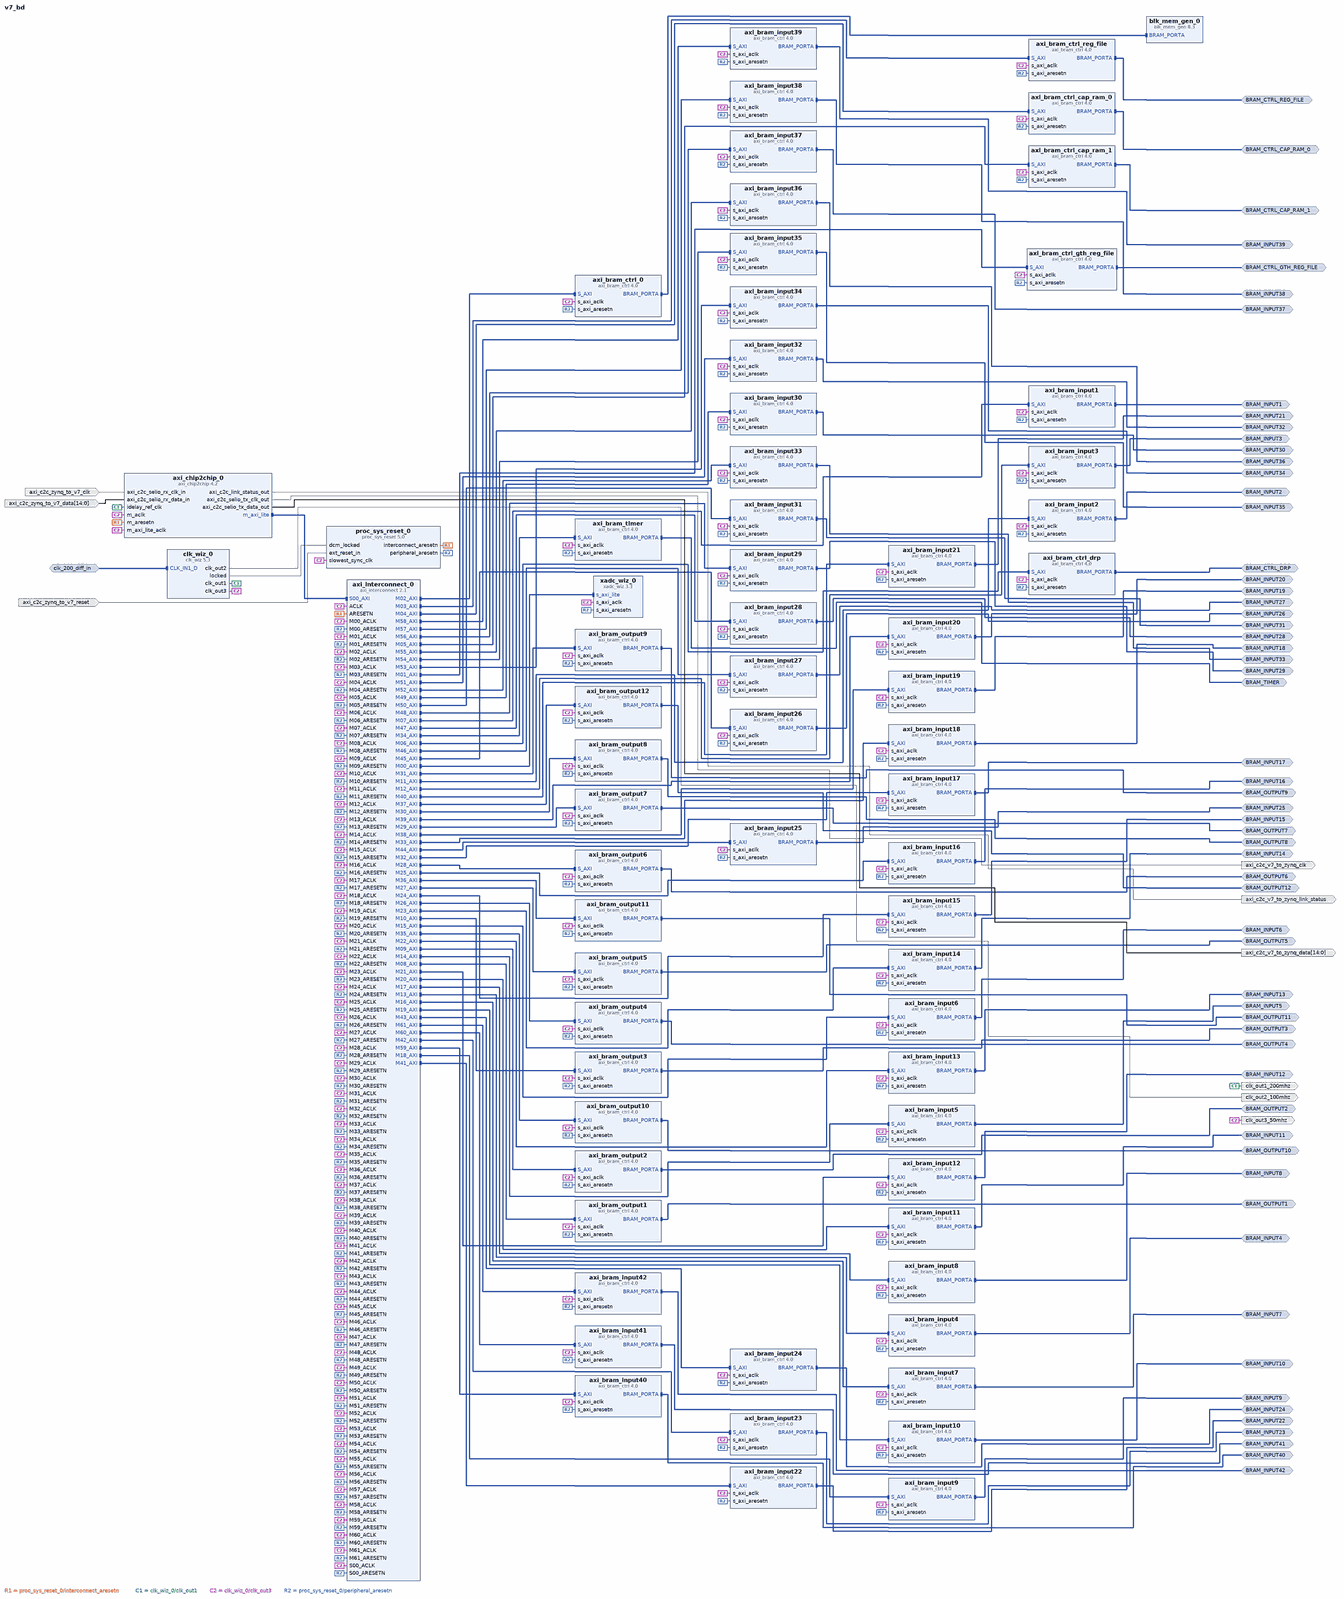
[diagram p0: block diagram of the top level, whole]
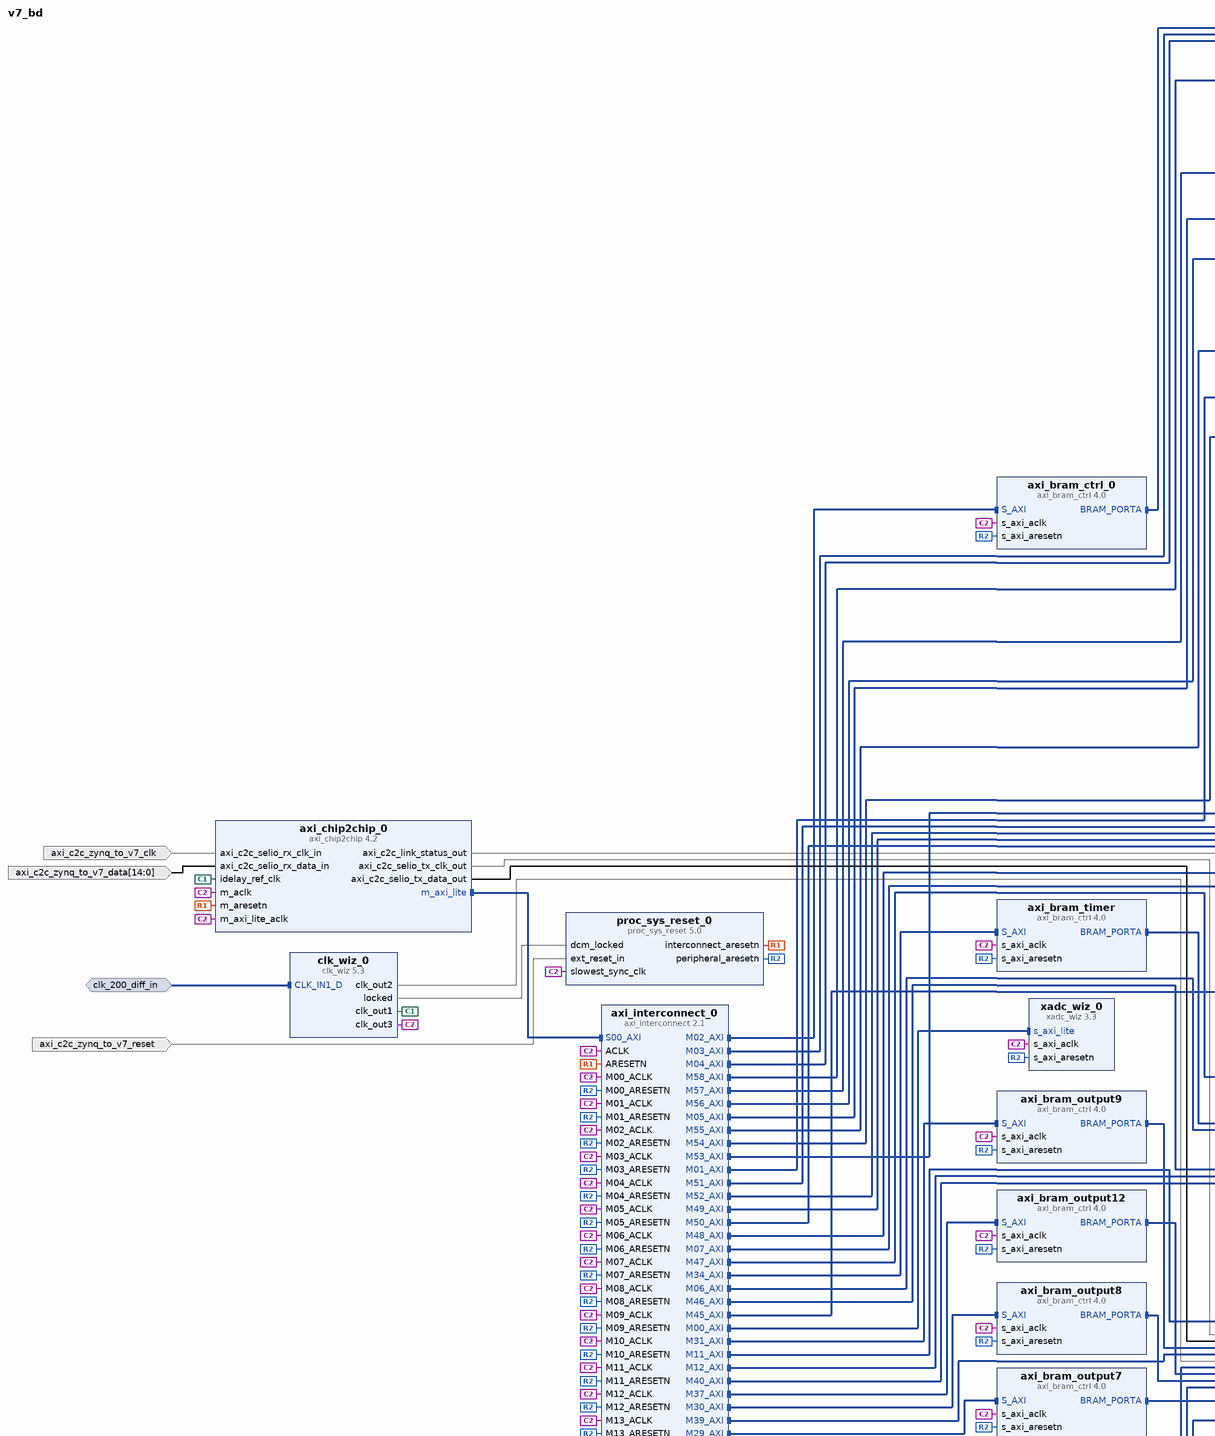
[diagram p1: block diagram of the top level, upper left part]
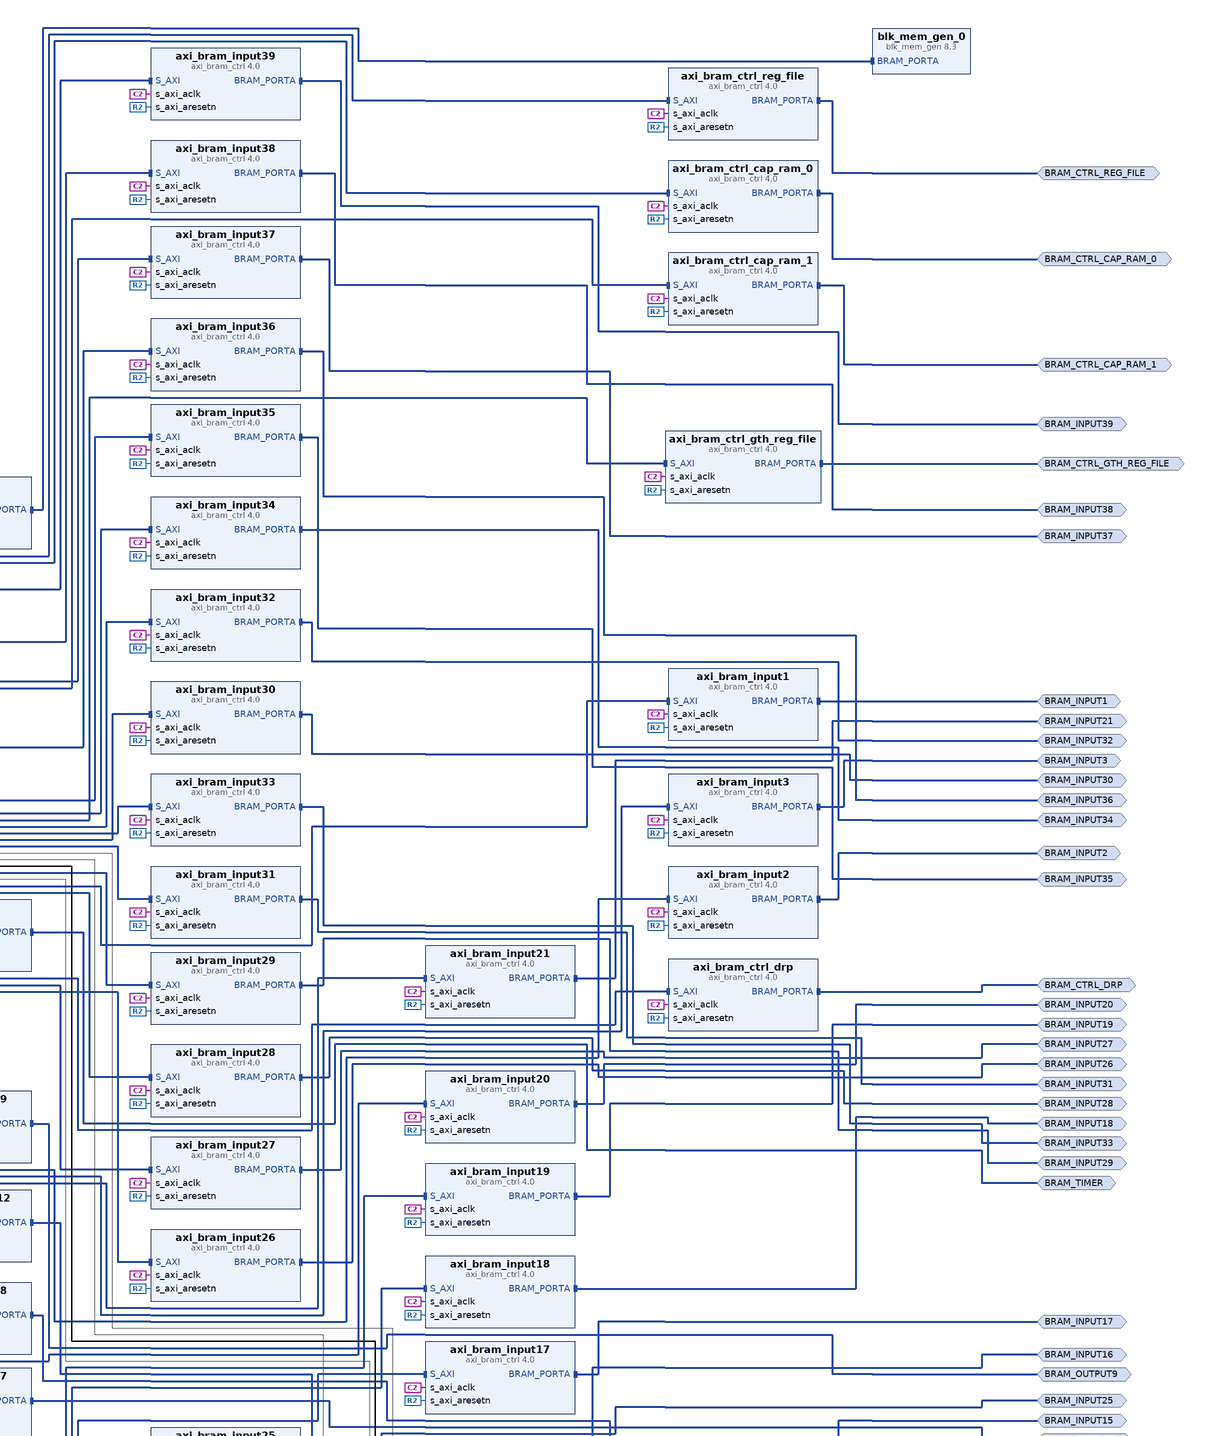
[diagram p2: block diagram of the top level, upper right part]
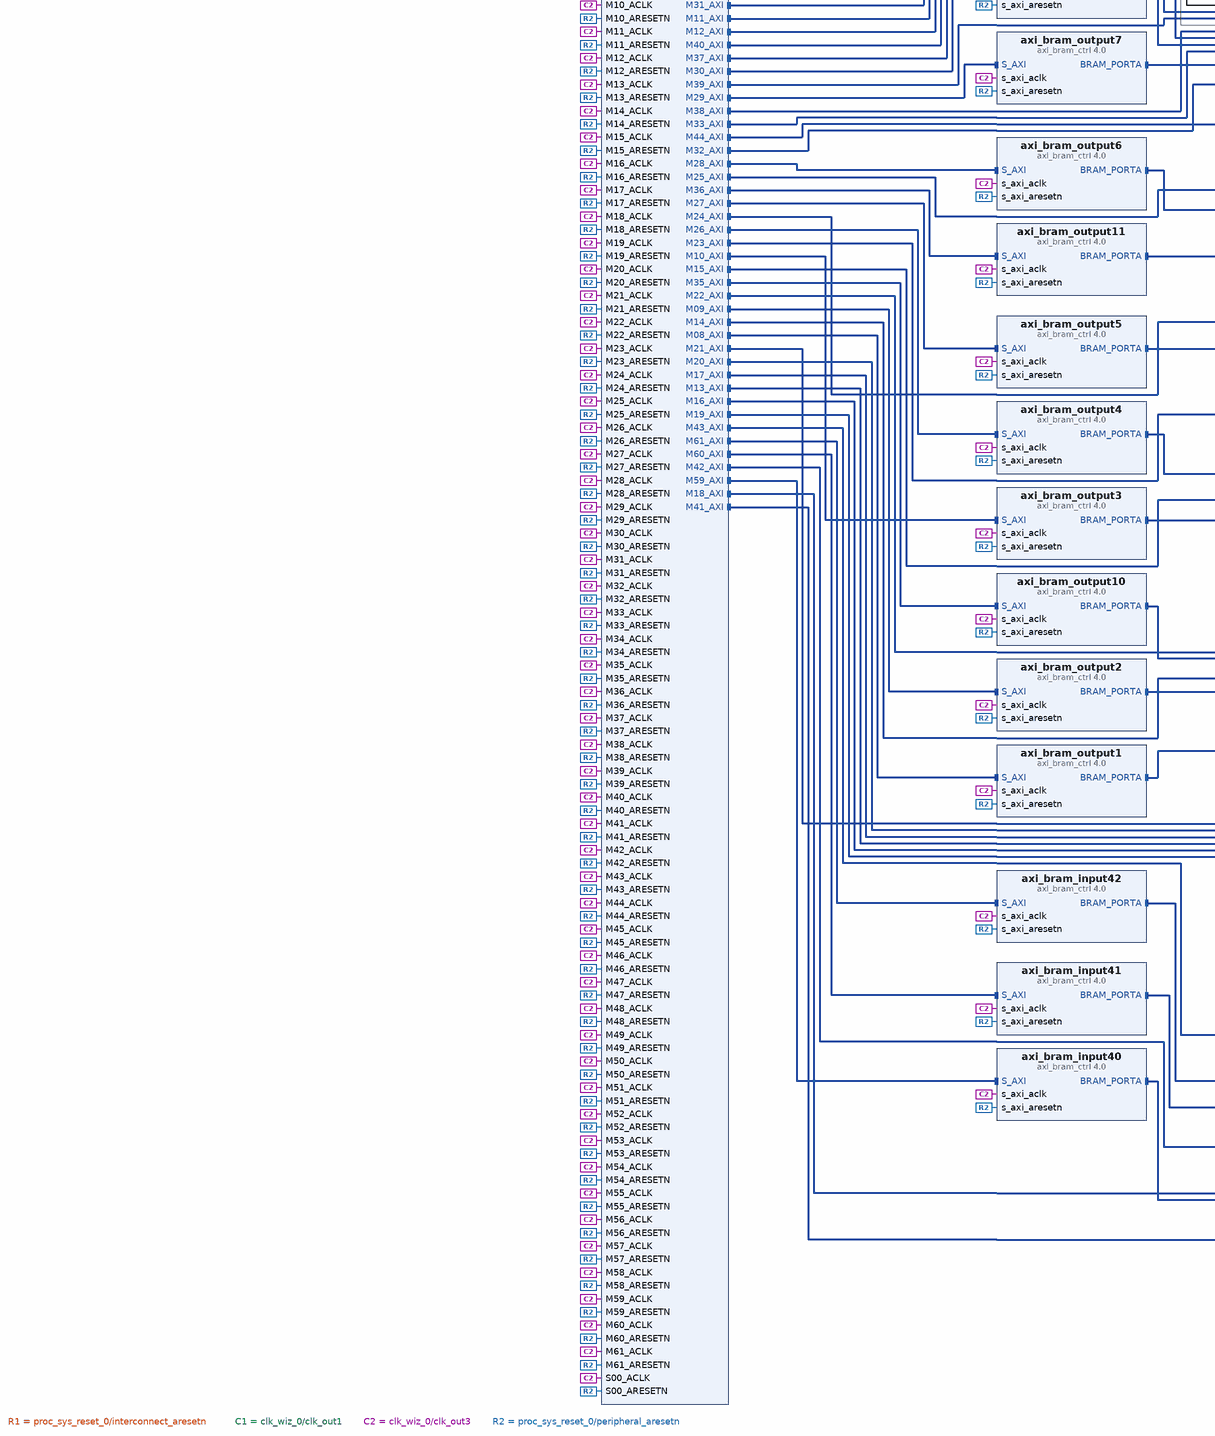
[diagram p3: block diagram of the top level, lower left part]
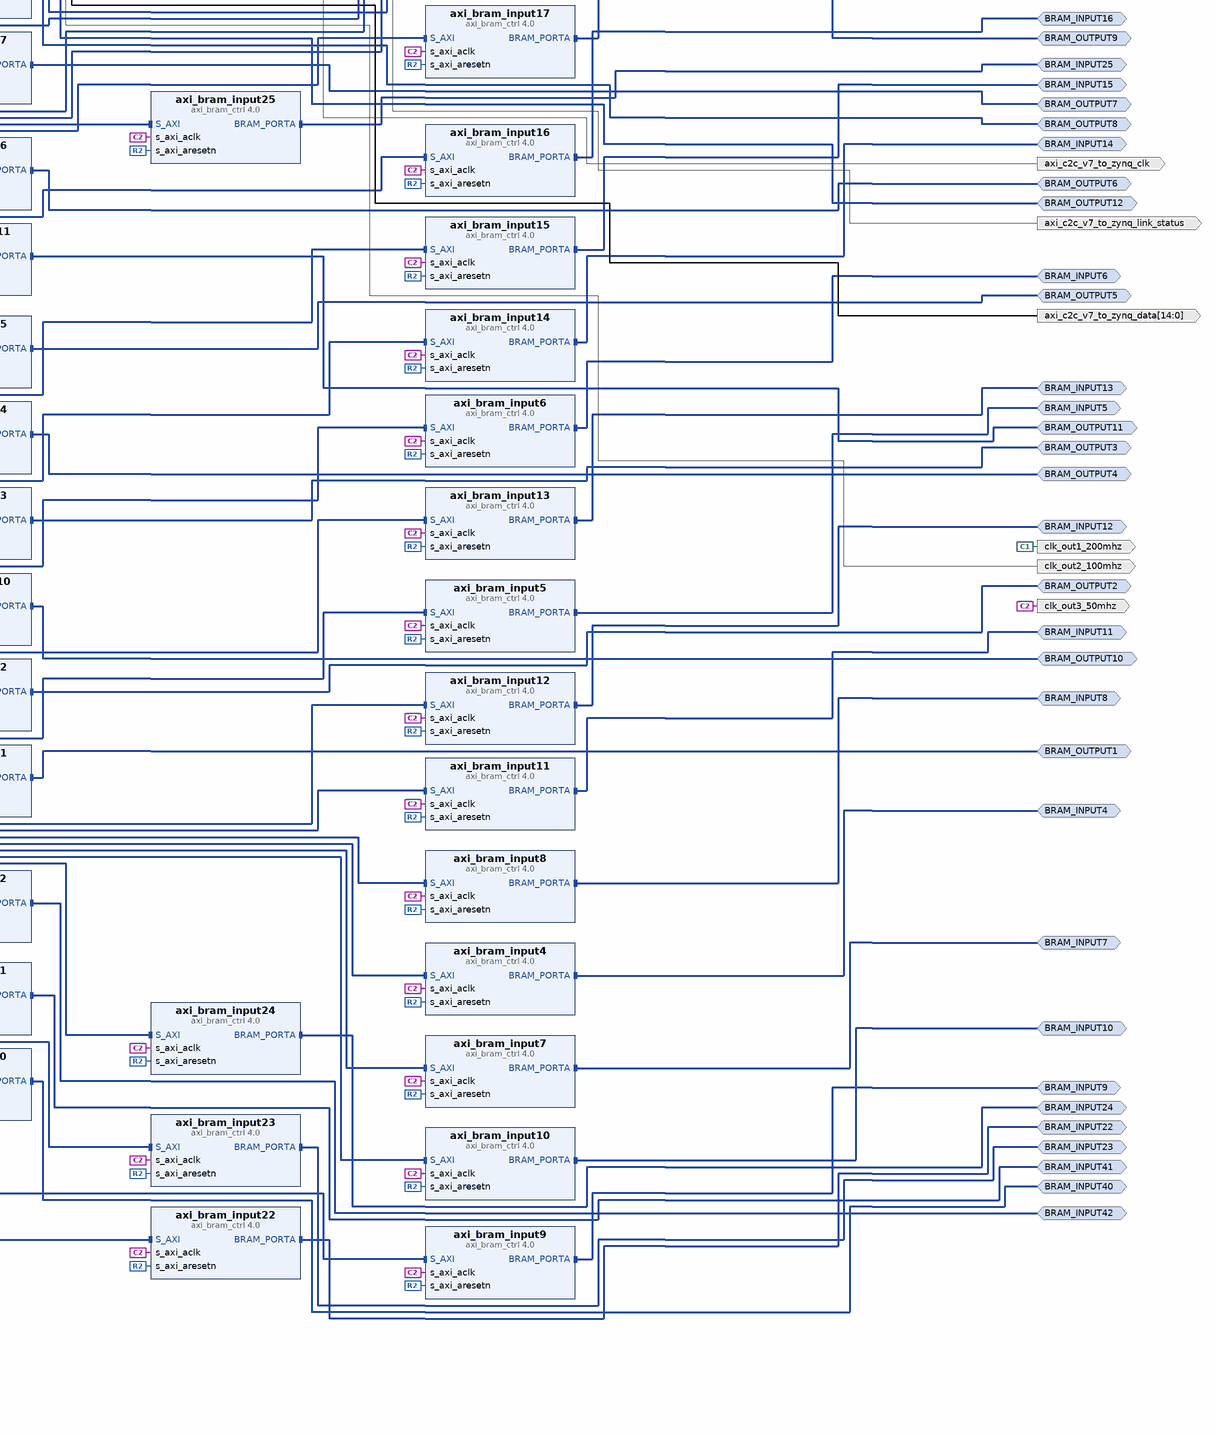
[diagram p4: block diagram of the top level, lower right part]
# Vivado block design v7_bd, Vivado 2016.1
create_bd_design v7_bd

create_bd_intf_port -mode Master -vlnv xilinx.com:interface:bram_rtl:1.0 BRAM_CTRL_CAP_RAM_0
set_property -dict {CONFIG.MASTER_TYPE BRAM_CTRL} [get_bd_intf_ports BRAM_CTRL_CAP_RAM_0]
create_bd_intf_port -mode Master -vlnv xilinx.com:interface:bram_rtl:1.0 BRAM_CTRL_CAP_RAM_1
set_property -dict {CONFIG.MASTER_TYPE BRAM_CTRL} [get_bd_intf_ports BRAM_CTRL_CAP_RAM_1]
create_bd_intf_port -mode Master -vlnv xilinx.com:interface:bram_rtl:1.0 BRAM_CTRL_DRP
set_property -dict {CONFIG.MASTER_TYPE BRAM_CTRL} [get_bd_intf_ports BRAM_CTRL_DRP]
create_bd_intf_port -mode Master -vlnv xilinx.com:interface:bram_rtl:1.0 BRAM_CTRL_REG_FILE
set_property -dict {CONFIG.MASTER_TYPE BRAM_CTRL} [get_bd_intf_ports BRAM_CTRL_REG_FILE]
create_bd_intf_port -mode Slave -vlnv xilinx.com:interface:diff_clock_rtl:1.0 clk_200_diff_in
set_property -dict {CONFIG.FREQ_HZ 200000000} [get_bd_intf_ports clk_200_diff_in]
create_bd_intf_port -mode Master -vlnv xilinx.com:interface:bram_rtl:1.0 BRAM_CTRL_GTH_REG_FILE
set_property -dict {CONFIG.MASTER_TYPE BRAM_CTRL} [get_bd_intf_ports BRAM_CTRL_GTH_REG_FILE]
create_bd_intf_port -mode Master -vlnv xilinx.com:interface:bram_rtl:1.0 BRAM_INPUT1
set_property -dict {CONFIG.MASTER_TYPE BRAM_CTRL} [get_bd_intf_ports BRAM_INPUT1]
create_bd_intf_port -mode Master -vlnv xilinx.com:interface:bram_rtl:1.0 BRAM_OUTPUT1
set_property -dict {CONFIG.MASTER_TYPE BRAM_CTRL} [get_bd_intf_ports BRAM_OUTPUT1]
create_bd_intf_port -mode Master -vlnv xilinx.com:interface:bram_rtl:1.0 BRAM_OUTPUT2
set_property -dict {CONFIG.MASTER_TYPE BRAM_CTRL} [get_bd_intf_ports BRAM_OUTPUT2]
create_bd_intf_port -mode Master -vlnv xilinx.com:interface:bram_rtl:1.0 BRAM_OUTPUT3
set_property -dict {CONFIG.MASTER_TYPE BRAM_CTRL} [get_bd_intf_ports BRAM_OUTPUT3]
create_bd_intf_port -mode Master -vlnv xilinx.com:interface:bram_rtl:1.0 BRAM_INPUT2
set_property -dict {CONFIG.MASTER_TYPE BRAM_CTRL} [get_bd_intf_ports BRAM_INPUT2]
create_bd_intf_port -mode Master -vlnv xilinx.com:interface:bram_rtl:1.0 BRAM_INPUT3
set_property -dict {CONFIG.MASTER_TYPE BRAM_CTRL} [get_bd_intf_ports BRAM_INPUT3]
create_bd_intf_port -mode Master -vlnv xilinx.com:interface:bram_rtl:1.0 BRAM_INPUT4
set_property -dict {CONFIG.MASTER_TYPE BRAM_CTRL} [get_bd_intf_ports BRAM_INPUT4]
create_bd_intf_port -mode Master -vlnv xilinx.com:interface:bram_rtl:1.0 BRAM_INPUT5
set_property -dict {CONFIG.MASTER_TYPE BRAM_CTRL} [get_bd_intf_ports BRAM_INPUT5]
create_bd_intf_port -mode Master -vlnv xilinx.com:interface:bram_rtl:1.0 BRAM_INPUT6
set_property -dict {CONFIG.MASTER_TYPE BRAM_CTRL} [get_bd_intf_ports BRAM_INPUT6]
create_bd_intf_port -mode Master -vlnv xilinx.com:interface:bram_rtl:1.0 BRAM_OUTPUT4
set_property -dict {CONFIG.MASTER_TYPE BRAM_CTRL} [get_bd_intf_ports BRAM_OUTPUT4]
create_bd_intf_port -mode Master -vlnv xilinx.com:interface:bram_rtl:1.0 BRAM_OUTPUT5
set_property -dict {CONFIG.MASTER_TYPE BRAM_CTRL} [get_bd_intf_ports BRAM_OUTPUT5]
create_bd_intf_port -mode Master -vlnv xilinx.com:interface:bram_rtl:1.0 BRAM_OUTPUT6
set_property -dict {CONFIG.MASTER_TYPE BRAM_CTRL} [get_bd_intf_ports BRAM_OUTPUT6]
create_bd_intf_port -mode Master -vlnv xilinx.com:interface:bram_rtl:1.0 BRAM_OUTPUT7
set_property -dict {CONFIG.MASTER_TYPE BRAM_CTRL} [get_bd_intf_ports BRAM_OUTPUT7]
create_bd_intf_port -mode Master -vlnv xilinx.com:interface:bram_rtl:1.0 BRAM_OUTPUT8
set_property -dict {CONFIG.MASTER_TYPE BRAM_CTRL} [get_bd_intf_ports BRAM_OUTPUT8]
create_bd_intf_port -mode Master -vlnv xilinx.com:interface:bram_rtl:1.0 BRAM_OUTPUT9
set_property -dict {CONFIG.MASTER_TYPE BRAM_CTRL} [get_bd_intf_ports BRAM_OUTPUT9]
create_bd_intf_port -mode Master -vlnv xilinx.com:interface:bram_rtl:1.0 BRAM_INPUT7
set_property -dict {CONFIG.MASTER_TYPE BRAM_CTRL} [get_bd_intf_ports BRAM_INPUT7]
create_bd_intf_port -mode Master -vlnv xilinx.com:interface:bram_rtl:1.0 BRAM_INPUT8
set_property -dict {CONFIG.MASTER_TYPE BRAM_CTRL} [get_bd_intf_ports BRAM_INPUT8]
create_bd_intf_port -mode Master -vlnv xilinx.com:interface:bram_rtl:1.0 BRAM_INPUT9
set_property -dict {CONFIG.MASTER_TYPE BRAM_CTRL} [get_bd_intf_ports BRAM_INPUT9]
create_bd_intf_port -mode Master -vlnv xilinx.com:interface:bram_rtl:1.0 BRAM_INPUT10
set_property -dict {CONFIG.MASTER_TYPE BRAM_CTRL} [get_bd_intf_ports BRAM_INPUT10]
create_bd_intf_port -mode Master -vlnv xilinx.com:interface:bram_rtl:1.0 BRAM_INPUT11
set_property -dict {CONFIG.MASTER_TYPE BRAM_CTRL} [get_bd_intf_ports BRAM_INPUT11]
create_bd_intf_port -mode Master -vlnv xilinx.com:interface:bram_rtl:1.0 BRAM_INPUT12
set_property -dict {CONFIG.MASTER_TYPE BRAM_CTRL} [get_bd_intf_ports BRAM_INPUT12]
create_bd_intf_port -mode Master -vlnv xilinx.com:interface:bram_rtl:1.0 BRAM_INPUT13
set_property -dict {CONFIG.MASTER_TYPE BRAM_CTRL} [get_bd_intf_ports BRAM_INPUT13]
create_bd_intf_port -mode Master -vlnv xilinx.com:interface:bram_rtl:1.0 BRAM_INPUT14
set_property -dict {CONFIG.MASTER_TYPE BRAM_CTRL} [get_bd_intf_ports BRAM_INPUT14]
create_bd_intf_port -mode Master -vlnv xilinx.com:interface:bram_rtl:1.0 BRAM_INPUT15
set_property -dict {CONFIG.MASTER_TYPE BRAM_CTRL} [get_bd_intf_ports BRAM_INPUT15]
create_bd_intf_port -mode Master -vlnv xilinx.com:interface:bram_rtl:1.0 BRAM_INPUT16
set_property -dict {CONFIG.MASTER_TYPE BRAM_CTRL} [get_bd_intf_ports BRAM_INPUT16]
create_bd_intf_port -mode Master -vlnv xilinx.com:interface:bram_rtl:1.0 BRAM_INPUT17
set_property -dict {CONFIG.MASTER_TYPE BRAM_CTRL} [get_bd_intf_ports BRAM_INPUT17]
create_bd_intf_port -mode Master -vlnv xilinx.com:interface:bram_rtl:1.0 BRAM_INPUT18
set_property -dict {CONFIG.MASTER_TYPE BRAM_CTRL} [get_bd_intf_ports BRAM_INPUT18]
create_bd_intf_port -mode Master -vlnv xilinx.com:interface:bram_rtl:1.0 BRAM_TIMER
set_property -dict {CONFIG.MASTER_TYPE BRAM_CTRL} [get_bd_intf_ports BRAM_TIMER]
create_bd_intf_port -mode Master -vlnv xilinx.com:interface:bram_rtl:1.0 BRAM_OUTPUT10
set_property -dict {CONFIG.MASTER_TYPE BRAM_CTRL} [get_bd_intf_ports BRAM_OUTPUT10]
create_bd_intf_port -mode Master -vlnv xilinx.com:interface:bram_rtl:1.0 BRAM_OUTPUT11
set_property -dict {CONFIG.MASTER_TYPE BRAM_CTRL} [get_bd_intf_ports BRAM_OUTPUT11]
create_bd_intf_port -mode Master -vlnv xilinx.com:interface:bram_rtl:1.0 BRAM_OUTPUT12
set_property -dict {CONFIG.MASTER_TYPE BRAM_CTRL} [get_bd_intf_ports BRAM_OUTPUT12]
create_bd_intf_port -mode Master -vlnv xilinx.com:interface:bram_rtl:1.0 BRAM_INPUT19
set_property -dict {CONFIG.MASTER_TYPE BRAM_CTRL} [get_bd_intf_ports BRAM_INPUT19]
create_bd_intf_port -mode Master -vlnv xilinx.com:interface:bram_rtl:1.0 BRAM_INPUT20
set_property -dict {CONFIG.MASTER_TYPE BRAM_CTRL} [get_bd_intf_ports BRAM_INPUT20]
create_bd_intf_port -mode Master -vlnv xilinx.com:interface:bram_rtl:1.0 BRAM_INPUT21
set_property -dict {CONFIG.MASTER_TYPE BRAM_CTRL} [get_bd_intf_ports BRAM_INPUT21]
create_bd_intf_port -mode Master -vlnv xilinx.com:interface:bram_rtl:1.0 BRAM_INPUT22
set_property -dict {CONFIG.MASTER_TYPE BRAM_CTRL} [get_bd_intf_ports BRAM_INPUT22]
create_bd_intf_port -mode Master -vlnv xilinx.com:interface:bram_rtl:1.0 BRAM_INPUT23
set_property -dict {CONFIG.MASTER_TYPE BRAM_CTRL} [get_bd_intf_ports BRAM_INPUT23]
create_bd_intf_port -mode Master -vlnv xilinx.com:interface:bram_rtl:1.0 BRAM_INPUT24
set_property -dict {CONFIG.MASTER_TYPE BRAM_CTRL} [get_bd_intf_ports BRAM_INPUT24]
create_bd_intf_port -mode Master -vlnv xilinx.com:interface:bram_rtl:1.0 BRAM_INPUT25
set_property -dict {CONFIG.MASTER_TYPE BRAM_CTRL} [get_bd_intf_ports BRAM_INPUT25]
create_bd_intf_port -mode Master -vlnv xilinx.com:interface:bram_rtl:1.0 BRAM_INPUT26
set_property -dict {CONFIG.MASTER_TYPE BRAM_CTRL} [get_bd_intf_ports BRAM_INPUT26]
create_bd_intf_port -mode Master -vlnv xilinx.com:interface:bram_rtl:1.0 BRAM_INPUT27
set_property -dict {CONFIG.MASTER_TYPE BRAM_CTRL} [get_bd_intf_ports BRAM_INPUT27]
create_bd_intf_port -mode Master -vlnv xilinx.com:interface:bram_rtl:1.0 BRAM_INPUT28
set_property -dict {CONFIG.MASTER_TYPE BRAM_CTRL} [get_bd_intf_ports BRAM_INPUT28]
create_bd_intf_port -mode Master -vlnv xilinx.com:interface:bram_rtl:1.0 BRAM_INPUT29
set_property -dict {CONFIG.MASTER_TYPE BRAM_CTRL} [get_bd_intf_ports BRAM_INPUT29]
create_bd_intf_port -mode Master -vlnv xilinx.com:interface:bram_rtl:1.0 BRAM_INPUT30
set_property -dict {CONFIG.MASTER_TYPE BRAM_CTRL} [get_bd_intf_ports BRAM_INPUT30]
create_bd_intf_port -mode Master -vlnv xilinx.com:interface:bram_rtl:1.0 BRAM_INPUT31
set_property -dict {CONFIG.MASTER_TYPE BRAM_CTRL} [get_bd_intf_ports BRAM_INPUT31]
create_bd_intf_port -mode Master -vlnv xilinx.com:interface:bram_rtl:1.0 BRAM_INPUT32
set_property -dict {CONFIG.MASTER_TYPE BRAM_CTRL} [get_bd_intf_ports BRAM_INPUT32]
create_bd_intf_port -mode Master -vlnv xilinx.com:interface:bram_rtl:1.0 BRAM_INPUT33
set_property -dict {CONFIG.MASTER_TYPE BRAM_CTRL} [get_bd_intf_ports BRAM_INPUT33]
create_bd_intf_port -mode Master -vlnv xilinx.com:interface:bram_rtl:1.0 BRAM_INPUT34
set_property -dict {CONFIG.MASTER_TYPE BRAM_CTRL} [get_bd_intf_ports BRAM_INPUT34]
create_bd_intf_port -mode Master -vlnv xilinx.com:interface:bram_rtl:1.0 BRAM_INPUT35
set_property -dict {CONFIG.MASTER_TYPE BRAM_CTRL} [get_bd_intf_ports BRAM_INPUT35]
create_bd_intf_port -mode Master -vlnv xilinx.com:interface:bram_rtl:1.0 BRAM_INPUT36
set_property -dict {CONFIG.MASTER_TYPE BRAM_CTRL} [get_bd_intf_ports BRAM_INPUT36]
create_bd_intf_port -mode Master -vlnv xilinx.com:interface:bram_rtl:1.0 BRAM_INPUT37
set_property -dict {CONFIG.MASTER_TYPE BRAM_CTRL} [get_bd_intf_ports BRAM_INPUT37]
create_bd_intf_port -mode Master -vlnv xilinx.com:interface:bram_rtl:1.0 BRAM_INPUT38
set_property -dict {CONFIG.MASTER_TYPE BRAM_CTRL} [get_bd_intf_ports BRAM_INPUT38]
create_bd_intf_port -mode Master -vlnv xilinx.com:interface:bram_rtl:1.0 BRAM_INPUT39
set_property -dict {CONFIG.MASTER_TYPE BRAM_CTRL} [get_bd_intf_ports BRAM_INPUT39]
create_bd_intf_port -mode Master -vlnv xilinx.com:interface:bram_rtl:1.0 BRAM_INPUT40
set_property -dict {CONFIG.MASTER_TYPE BRAM_CTRL} [get_bd_intf_ports BRAM_INPUT40]
create_bd_intf_port -mode Master -vlnv xilinx.com:interface:bram_rtl:1.0 BRAM_INPUT41
set_property -dict {CONFIG.MASTER_TYPE BRAM_CTRL} [get_bd_intf_ports BRAM_INPUT41]
create_bd_intf_port -mode Master -vlnv xilinx.com:interface:bram_rtl:1.0 BRAM_INPUT42
set_property -dict {CONFIG.MASTER_TYPE BRAM_CTRL} [get_bd_intf_ports BRAM_INPUT42]
create_bd_port -dir I -type clk axi_c2c_zynq_to_v7_clk
set_property -dict {CONFIG.FREQ_HZ 200000000} [get_bd_ports axi_c2c_zynq_to_v7_clk]
create_bd_port -dir I -from 14 -to 0 axi_c2c_zynq_to_v7_data
create_bd_port -dir O axi_c2c_v7_to_zynq_link_status
create_bd_port -dir O -type clk axi_c2c_v7_to_zynq_clk
create_bd_port -dir O -from 14 -to 0 axi_c2c_v7_to_zynq_data
create_bd_port -dir O -type clk clk_out1_200mhz
create_bd_port -dir O -type clk clk_out2_100mhz
create_bd_port -dir O -type clk clk_out3_50mhz
create_bd_port -dir I -type rst axi_c2c_zynq_to_v7_reset

create_bd_cell -type ip -vlnv xilinx.com:ip:axi_bram_ctrl:4.0 axi_bram_ctrl_0
set_property -dict {CONFIG.SINGLE_PORT_BRAM 1} [get_bd_cells axi_bram_ctrl_0]
create_bd_cell -type ip -vlnv xilinx.com:ip:axi_bram_ctrl:4.0 axi_bram_ctrl_cap_ram_0
set_property -dict {CONFIG.PROTOCOL AXI4LITE CONFIG.SINGLE_PORT_BRAM 1} [get_bd_cells axi_bram_ctrl_cap_ram_0]
create_bd_cell -type ip -vlnv xilinx.com:ip:axi_bram_ctrl:4.0 axi_bram_ctrl_cap_ram_1
set_property -dict {CONFIG.PROTOCOL AXI4LITE CONFIG.SINGLE_PORT_BRAM 1} [get_bd_cells axi_bram_ctrl_cap_ram_1]
create_bd_cell -type ip -vlnv xilinx.com:ip:axi_bram_ctrl:4.0 axi_bram_ctrl_drp
set_property -dict {CONFIG.PROTOCOL AXI4LITE CONFIG.SINGLE_PORT_BRAM 1} [get_bd_cells axi_bram_ctrl_drp]
create_bd_cell -type ip -vlnv xilinx.com:ip:axi_bram_ctrl:4.0 axi_bram_input1
set_property -dict {CONFIG.PROTOCOL AXI4LITE CONFIG.SINGLE_PORT_BRAM 1} [get_bd_cells axi_bram_input1]
create_bd_cell -type ip -vlnv xilinx.com:ip:axi_bram_ctrl:4.0 axi_bram_ctrl_reg_file
set_property -dict {CONFIG.PROTOCOL AXI4LITE CONFIG.SINGLE_PORT_BRAM 1} [get_bd_cells axi_bram_ctrl_reg_file]
create_bd_cell -type ip -vlnv xilinx.com:ip:axi_bram_ctrl:4.0 axi_bram_ctrl_gth_reg_file
set_property -dict {CONFIG.PROTOCOL AXI4LITE CONFIG.SINGLE_PORT_BRAM 1} [get_bd_cells axi_bram_ctrl_gth_reg_file]
create_bd_cell -type ip -vlnv xilinx.com:ip:axi_bram_ctrl:4.0 axi_bram_input3
set_property -dict {CONFIG.PROTOCOL AXI4LITE CONFIG.SINGLE_PORT_BRAM 1} [get_bd_cells axi_bram_input3]
create_bd_cell -type ip -vlnv xilinx.com:ip:axi_bram_ctrl:4.0 axi_bram_input5
set_property -dict {CONFIG.PROTOCOL AXI4LITE CONFIG.SINGLE_PORT_BRAM 1} [get_bd_cells axi_bram_input5]
create_bd_cell -type ip -vlnv xilinx.com:ip:axi_bram_ctrl:4.0 axi_bram_input7
set_property -dict {CONFIG.PROTOCOL AXI4LITE CONFIG.SINGLE_PORT_BRAM 1} [get_bd_cells axi_bram_input7]
create_bd_cell -type ip -vlnv xilinx.com:ip:axi_bram_ctrl:4.0 axi_bram_input13
set_property -dict {CONFIG.PROTOCOL AXI4LITE CONFIG.SINGLE_PORT_BRAM 1} [get_bd_cells axi_bram_input13]
create_bd_cell -type ip -vlnv xilinx.com:ip:axi_bram_ctrl:4.0 axi_bram_input4
set_property -dict {CONFIG.PROTOCOL AXI4LITE CONFIG.SINGLE_PORT_BRAM 1} [get_bd_cells axi_bram_input4]
create_bd_cell -type ip -vlnv xilinx.com:ip:axi_bram_ctrl:4.0 axi_bram_input6
set_property -dict {CONFIG.PROTOCOL AXI4LITE CONFIG.SINGLE_PORT_BRAM 1} [get_bd_cells axi_bram_input6]
create_bd_cell -type ip -vlnv xilinx.com:ip:axi_bram_ctrl:4.0 axi_bram_input8
set_property -dict {CONFIG.PROTOCOL AXI4LITE CONFIG.SINGLE_PORT_BRAM 1} [get_bd_cells axi_bram_input8]
create_bd_cell -type ip -vlnv xilinx.com:ip:axi_bram_ctrl:4.0 axi_bram_input14
set_property -dict {CONFIG.PROTOCOL AXI4LITE CONFIG.SINGLE_PORT_BRAM 1} [get_bd_cells axi_bram_input14]
create_bd_cell -type ip -vlnv xilinx.com:ip:axi_bram_ctrl:4.0 axi_bram_input9
set_property -dict {CONFIG.PROTOCOL AXI4LITE CONFIG.SINGLE_PORT_BRAM 1} [get_bd_cells axi_bram_input9]
create_bd_cell -type ip -vlnv xilinx.com:ip:axi_bram_ctrl:4.0 axi_bram_input15
set_property -dict {CONFIG.PROTOCOL AXI4LITE CONFIG.SINGLE_PORT_BRAM 1} [get_bd_cells axi_bram_input15]
create_bd_cell -type ip -vlnv xilinx.com:ip:axi_bram_ctrl:4.0 axi_bram_input10
set_property -dict {CONFIG.PROTOCOL AXI4LITE CONFIG.SINGLE_PORT_BRAM 1} [get_bd_cells axi_bram_input10]
create_bd_cell -type ip -vlnv xilinx.com:ip:axi_bram_ctrl:4.0 axi_bram_input16
set_property -dict {CONFIG.PROTOCOL AXI4LITE CONFIG.SINGLE_PORT_BRAM 1} [get_bd_cells axi_bram_input16]
create_bd_cell -type ip -vlnv xilinx.com:ip:axi_bram_ctrl:4.0 axi_bram_input11
set_property -dict {CONFIG.PROTOCOL AXI4LITE CONFIG.SINGLE_PORT_BRAM 1} [get_bd_cells axi_bram_input11]
create_bd_cell -type ip -vlnv xilinx.com:ip:axi_bram_ctrl:4.0 axi_bram_input17
set_property -dict {CONFIG.PROTOCOL AXI4LITE CONFIG.SINGLE_PORT_BRAM 1} [get_bd_cells axi_bram_input17]
create_bd_cell -type ip -vlnv xilinx.com:ip:axi_bram_ctrl:4.0 axi_bram_input12
set_property -dict {CONFIG.PROTOCOL AXI4LITE CONFIG.SINGLE_PORT_BRAM 1} [get_bd_cells axi_bram_input12]
create_bd_cell -type ip -vlnv xilinx.com:ip:axi_bram_ctrl:4.0 axi_bram_input18
set_property -dict {CONFIG.PROTOCOL AXI4LITE CONFIG.SINGLE_PORT_BRAM 1} [get_bd_cells axi_bram_input18]
create_bd_cell -type ip -vlnv xilinx.com:ip:axi_bram_ctrl:4.0 axi_bram_output1
set_property -dict {CONFIG.PROTOCOL AXI4LITE CONFIG.SINGLE_PORT_BRAM 1} [get_bd_cells axi_bram_output1]
create_bd_cell -type ip -vlnv xilinx.com:ip:axi_bram_ctrl:4.0 axi_bram_input2
set_property -dict {CONFIG.PROTOCOL AXI4LITE CONFIG.SINGLE_PORT_BRAM 1} [get_bd_cells axi_bram_input2]
create_bd_cell -type ip -vlnv xilinx.com:ip:axi_bram_ctrl:4.0 axi_bram_output3
set_property -dict {CONFIG.PROTOCOL AXI4LITE CONFIG.SINGLE_PORT_BRAM 1} [get_bd_cells axi_bram_output3]
create_bd_cell -type ip -vlnv xilinx.com:ip:axi_bram_ctrl:4.0 axi_bram_output4
set_property -dict {CONFIG.PROTOCOL AXI4LITE CONFIG.SINGLE_PORT_BRAM 1} [get_bd_cells axi_bram_output4]
create_bd_cell -type ip -vlnv xilinx.com:ip:axi_bram_ctrl:4.0 axi_bram_output7
set_property -dict {CONFIG.PROTOCOL AXI4LITE CONFIG.SINGLE_PORT_BRAM 1} [get_bd_cells axi_bram_output7]
create_bd_cell -type ip -vlnv xilinx.com:ip:axi_bram_ctrl:4.0 axi_bram_output5
set_property -dict {CONFIG.PROTOCOL AXI4LITE CONFIG.SINGLE_PORT_BRAM 1} [get_bd_cells axi_bram_output5]
create_bd_cell -type ip -vlnv xilinx.com:ip:axi_bram_ctrl:4.0 axi_bram_output8
set_property -dict {CONFIG.PROTOCOL AXI4LITE CONFIG.SINGLE_PORT_BRAM 1} [get_bd_cells axi_bram_output8]
create_bd_cell -type ip -vlnv xilinx.com:ip:axi_bram_ctrl:4.0 axi_bram_output6
set_property -dict {CONFIG.PROTOCOL AXI4LITE CONFIG.SINGLE_PORT_BRAM 1} [get_bd_cells axi_bram_output6]
create_bd_cell -type ip -vlnv xilinx.com:ip:axi_bram_ctrl:4.0 axi_bram_output9
set_property -dict {CONFIG.PROTOCOL AXI4LITE CONFIG.SINGLE_PORT_BRAM 1} [get_bd_cells axi_bram_output9]
create_bd_cell -type ip -vlnv xilinx.com:ip:axi_bram_ctrl:4.0 axi_bram_output2
set_property -dict {CONFIG.PROTOCOL AXI4LITE CONFIG.SINGLE_PORT_BRAM 1} [get_bd_cells axi_bram_output2]
create_bd_cell -type ip -vlnv xilinx.com:ip:axi_chip2chip:4.2 axi_chip2chip_0
set_property -dict [list \
  CONFIG.C_AXI_WUSER_WIDTH 1 \
  CONFIG.C_AXI_ID_WIDTH 1 \
  CONFIG.C_INCLUDE_AXILITE 2 \
  CONFIG.C_SELECTIO_PHY_CLK 200 \
  CONFIG.C_INTERFACE_MODE 1 \
  CONFIG.C_COMMON_CLK 0 \
  CONFIG.C_MASTER_FPGA 0 \
  CONFIG.C_AURORA_WIDTH 64 \
] [get_bd_cells axi_chip2chip_0]
create_bd_cell -type ip -vlnv xilinx.com:ip:axi_interconnect:2.1 axi_interconnect_0
set_property -dict {CONFIG.NUM_SI 1 CONFIG.NUM_MI 62} [get_bd_cells axi_interconnect_0]
create_bd_cell -type ip -vlnv xilinx.com:ip:blk_mem_gen:8.3 blk_mem_gen_0
create_bd_cell -type ip -vlnv xilinx.com:ip:clk_wiz:5.3 clk_wiz_0
set_property -dict [list \
  CONFIG.USE_PHASE_ALIGNMENT false \
  CONFIG.USE_DYN_RECONFIG false \
  CONFIG.PRIM_IN_FREQ 200 \
  CONFIG.CLKIN1_JITTER_PS 50.0 \
  CONFIG.CLKOUT2_USED true \
  CONFIG.CLKOUT3_USED true \
  CONFIG.CLKOUT4_USED false \
  CONFIG.NUM_OUT_CLKS 3 \
  CONFIG.CLKOUT1_REQUESTED_OUT_FREQ 200 \
  CONFIG.CLKOUT2_REQUESTED_OUT_FREQ 100 \
  CONFIG.CLKOUT3_REQUESTED_OUT_FREQ 50 \
  CONFIG.PRIM_SOURCE Differential_clock_capable_pin \
  CONFIG.CLKOUT1_DRIVES BUFGCE \
  CONFIG.CLKOUT2_DRIVES BUFGCE \
  CONFIG.CLKOUT3_DRIVES BUFGCE \
  CONFIG.USE_RESET false \
  CONFIG.USE_SAFE_CLOCK_STARTUP true \
  CONFIG.CLKOUT1_JITTER 98.146 \
  CONFIG.CLKOUT1_PHASE_ERROR 89.971 \
  CONFIG.CLKOUT2_JITTER 112.316 \
  CONFIG.CLKOUT2_PHASE_ERROR 89.971 \
  CONFIG.CLKOUT3_JITTER 129.198 \
  CONFIG.CLKOUT3_PHASE_ERROR 89.971 \
  CONFIG.CLKOUT4_JITTER 89.608 \
  CONFIG.CLKOUT4_PHASE_ERROR 82.655 \
  CONFIG.CLKOUT5_JITTER 127.032 \
  CONFIG.CLKOUT5_PHASE_ERROR 82.655 \
] [get_bd_cells clk_wiz_0]
create_bd_cell -type ip -vlnv xilinx.com:ip:proc_sys_reset:5.0 proc_sys_reset_0
set_property -dict {CONFIG.C_AUX_RESET_HIGH 0} [get_bd_cells proc_sys_reset_0]
create_bd_cell -type ip -vlnv xilinx.com:ip:xadc_wiz:3.3 xadc_wiz_0
set_property -dict [list \
  CONFIG.INTERFACE_SELECTION Enable_AXI \
  CONFIG.DCLK_FREQUENCY 50 \
  CONFIG.ADC_CONVERSION_RATE 962 \
  CONFIG.OT_ALARM false \
  CONFIG.USER_TEMP_ALARM false \
  CONFIG.VCCINT_ALARM false \
  CONFIG.VCCAUX_ALARM false \
] [get_bd_cells xadc_wiz_0]
create_bd_cell -type ip -vlnv xilinx.com:ip:axi_bram_ctrl:4.0 axi_bram_timer
set_property -dict {CONFIG.PROTOCOL AXI4LITE CONFIG.SINGLE_PORT_BRAM 1} [get_bd_cells axi_bram_timer]
create_bd_cell -type ip -vlnv xilinx.com:ip:axi_bram_ctrl:4.0 axi_bram_output10
set_property -dict {CONFIG.PROTOCOL AXI4LITE CONFIG.SINGLE_PORT_BRAM 1} [get_bd_cells axi_bram_output10]
create_bd_cell -type ip -vlnv xilinx.com:ip:axi_bram_ctrl:4.0 axi_bram_output11
set_property -dict {CONFIG.PROTOCOL AXI4LITE CONFIG.SINGLE_PORT_BRAM 1} [get_bd_cells axi_bram_output11]
create_bd_cell -type ip -vlnv xilinx.com:ip:axi_bram_ctrl:4.0 axi_bram_output12
set_property -dict {CONFIG.PROTOCOL AXI4LITE CONFIG.SINGLE_PORT_BRAM 1} [get_bd_cells axi_bram_output12]
create_bd_cell -type ip -vlnv xilinx.com:ip:axi_bram_ctrl:4.0 axi_bram_input19
set_property -dict {CONFIG.PROTOCOL AXI4LITE CONFIG.SINGLE_PORT_BRAM 1} [get_bd_cells axi_bram_input19]
create_bd_cell -type ip -vlnv xilinx.com:ip:axi_bram_ctrl:4.0 axi_bram_input20
set_property -dict {CONFIG.PROTOCOL AXI4LITE CONFIG.SINGLE_PORT_BRAM 1} [get_bd_cells axi_bram_input20]
create_bd_cell -type ip -vlnv xilinx.com:ip:axi_bram_ctrl:4.0 axi_bram_input21
set_property -dict {CONFIG.PROTOCOL AXI4LITE CONFIG.SINGLE_PORT_BRAM 1} [get_bd_cells axi_bram_input21]
create_bd_cell -type ip -vlnv xilinx.com:ip:axi_bram_ctrl:4.0 axi_bram_input22
set_property -dict {CONFIG.PROTOCOL AXI4LITE CONFIG.SINGLE_PORT_BRAM 1} [get_bd_cells axi_bram_input22]
create_bd_cell -type ip -vlnv xilinx.com:ip:axi_bram_ctrl:4.0 axi_bram_input23
set_property -dict {CONFIG.PROTOCOL AXI4LITE CONFIG.SINGLE_PORT_BRAM 1} [get_bd_cells axi_bram_input23]
create_bd_cell -type ip -vlnv xilinx.com:ip:axi_bram_ctrl:4.0 axi_bram_input24
set_property -dict {CONFIG.PROTOCOL AXI4LITE CONFIG.SINGLE_PORT_BRAM 1} [get_bd_cells axi_bram_input24]
create_bd_cell -type ip -vlnv xilinx.com:ip:axi_bram_ctrl:4.0 axi_bram_input25
set_property -dict {CONFIG.PROTOCOL AXI4LITE CONFIG.SINGLE_PORT_BRAM 1} [get_bd_cells axi_bram_input25]
create_bd_cell -type ip -vlnv xilinx.com:ip:axi_bram_ctrl:4.0 axi_bram_input26
set_property -dict {CONFIG.PROTOCOL AXI4LITE CONFIG.SINGLE_PORT_BRAM 1} [get_bd_cells axi_bram_input26]
create_bd_cell -type ip -vlnv xilinx.com:ip:axi_bram_ctrl:4.0 axi_bram_input27
set_property -dict {CONFIG.PROTOCOL AXI4LITE CONFIG.SINGLE_PORT_BRAM 1} [get_bd_cells axi_bram_input27]
create_bd_cell -type ip -vlnv xilinx.com:ip:axi_bram_ctrl:4.0 axi_bram_input28
set_property -dict {CONFIG.PROTOCOL AXI4LITE CONFIG.SINGLE_PORT_BRAM 1} [get_bd_cells axi_bram_input28]
create_bd_cell -type ip -vlnv xilinx.com:ip:axi_bram_ctrl:4.0 axi_bram_input29
set_property -dict {CONFIG.PROTOCOL AXI4LITE CONFIG.SINGLE_PORT_BRAM 1} [get_bd_cells axi_bram_input29]
create_bd_cell -type ip -vlnv xilinx.com:ip:axi_bram_ctrl:4.0 axi_bram_input30
set_property -dict {CONFIG.PROTOCOL AXI4LITE CONFIG.SINGLE_PORT_BRAM 1} [get_bd_cells axi_bram_input30]
create_bd_cell -type ip -vlnv xilinx.com:ip:axi_bram_ctrl:4.0 axi_bram_input31
set_property -dict {CONFIG.PROTOCOL AXI4LITE CONFIG.SINGLE_PORT_BRAM 1} [get_bd_cells axi_bram_input31]
create_bd_cell -type ip -vlnv xilinx.com:ip:axi_bram_ctrl:4.0 axi_bram_input32
set_property -dict {CONFIG.PROTOCOL AXI4LITE CONFIG.SINGLE_PORT_BRAM 1} [get_bd_cells axi_bram_input32]
create_bd_cell -type ip -vlnv xilinx.com:ip:axi_bram_ctrl:4.0 axi_bram_input33
set_property -dict {CONFIG.PROTOCOL AXI4LITE CONFIG.SINGLE_PORT_BRAM 1} [get_bd_cells axi_bram_input33]
create_bd_cell -type ip -vlnv xilinx.com:ip:axi_bram_ctrl:4.0 axi_bram_input34
set_property -dict {CONFIG.PROTOCOL AXI4LITE CONFIG.SINGLE_PORT_BRAM 1} [get_bd_cells axi_bram_input34]
create_bd_cell -type ip -vlnv xilinx.com:ip:axi_bram_ctrl:4.0 axi_bram_input35
set_property -dict {CONFIG.PROTOCOL AXI4LITE CONFIG.SINGLE_PORT_BRAM 1} [get_bd_cells axi_bram_input35]
create_bd_cell -type ip -vlnv xilinx.com:ip:axi_bram_ctrl:4.0 axi_bram_input36
set_property -dict {CONFIG.PROTOCOL AXI4LITE CONFIG.SINGLE_PORT_BRAM 1} [get_bd_cells axi_bram_input36]
create_bd_cell -type ip -vlnv xilinx.com:ip:axi_bram_ctrl:4.0 axi_bram_input37
set_property -dict {CONFIG.PROTOCOL AXI4LITE CONFIG.SINGLE_PORT_BRAM 1} [get_bd_cells axi_bram_input37]
create_bd_cell -type ip -vlnv xilinx.com:ip:axi_bram_ctrl:4.0 axi_bram_input38
set_property -dict {CONFIG.PROTOCOL AXI4LITE CONFIG.SINGLE_PORT_BRAM 1} [get_bd_cells axi_bram_input38]
create_bd_cell -type ip -vlnv xilinx.com:ip:axi_bram_ctrl:4.0 axi_bram_input39
set_property -dict {CONFIG.PROTOCOL AXI4LITE CONFIG.SINGLE_PORT_BRAM 1} [get_bd_cells axi_bram_input39]
create_bd_cell -type ip -vlnv xilinx.com:ip:axi_bram_ctrl:4.0 axi_bram_input40
set_property -dict {CONFIG.PROTOCOL AXI4LITE CONFIG.SINGLE_PORT_BRAM 1} [get_bd_cells axi_bram_input40]
create_bd_cell -type ip -vlnv xilinx.com:ip:axi_bram_ctrl:4.0 axi_bram_input41
set_property -dict {CONFIG.PROTOCOL AXI4LITE CONFIG.SINGLE_PORT_BRAM 1} [get_bd_cells axi_bram_input41]
create_bd_cell -type ip -vlnv xilinx.com:ip:axi_bram_ctrl:4.0 axi_bram_input42
set_property -dict {CONFIG.PROTOCOL AXI4LITE CONFIG.SINGLE_PORT_BRAM 1} [get_bd_cells axi_bram_input42]

# ---- connections ----

connect_bd_intf_net [get_bd_intf_pins axi_bram_ctrl_0/BRAM_PORTA] [get_bd_intf_pins blk_mem_gen_0/BRAM_PORTA]
connect_bd_intf_net [get_bd_intf_pins axi_interconnect_0/M00_AXI] [get_bd_intf_pins xadc_wiz_0/s_axi_lite]
connect_bd_intf_net [get_bd_intf_pins axi_bram_ctrl_0/S_AXI] [get_bd_intf_pins axi_interconnect_0/M02_AXI]
connect_bd_intf_net [get_bd_intf_pins axi_bram_ctrl_reg_file/S_AXI] [get_bd_intf_pins axi_interconnect_0/M03_AXI]
connect_bd_intf_net [get_bd_intf_pins axi_bram_ctrl_cap_ram_0/S_AXI] [get_bd_intf_pins axi_interconnect_0/M04_AXI]
connect_bd_intf_net [get_bd_intf_pins axi_bram_ctrl_cap_ram_1/S_AXI] [get_bd_intf_pins axi_interconnect_0/M05_AXI]
connect_bd_intf_net [get_bd_intf_pins axi_bram_ctrl_gth_reg_file/S_AXI] [get_bd_intf_pins axi_interconnect_0/M01_AXI]
connect_bd_intf_net [get_bd_intf_pins axi_bram_ctrl_drp/S_AXI] [get_bd_intf_pins axi_interconnect_0/M06_AXI]
connect_bd_intf_net [get_bd_intf_pins axi_interconnect_0/S00_AXI] [get_bd_intf_pins axi_chip2chip_0/m_axi_lite]
connect_bd_intf_net [get_bd_intf_pins axi_interconnect_0/M07_AXI] [get_bd_intf_pins axi_bram_input1/S_AXI]
connect_bd_intf_net [get_bd_intf_pins axi_interconnect_0/M08_AXI] [get_bd_intf_pins axi_bram_output1/S_AXI]
connect_bd_intf_net [get_bd_intf_pins axi_interconnect_0/M09_AXI] [get_bd_intf_pins axi_bram_output2/S_AXI]
connect_bd_intf_net [get_bd_intf_pins axi_interconnect_0/M10_AXI] [get_bd_intf_pins axi_bram_output3/S_AXI]
connect_bd_intf_net [get_bd_intf_pins axi_interconnect_0/M11_AXI] [get_bd_intf_pins axi_bram_input2/S_AXI]
connect_bd_intf_net [get_bd_intf_pins axi_interconnect_0/M12_AXI] [get_bd_intf_pins axi_bram_input3/S_AXI]
connect_bd_intf_net [get_bd_intf_pins axi_interconnect_0/M13_AXI] [get_bd_intf_pins axi_bram_input4/S_AXI]
connect_bd_intf_net [get_bd_intf_pins axi_interconnect_0/M14_AXI] [get_bd_intf_pins axi_bram_input5/S_AXI]
connect_bd_intf_net [get_bd_intf_pins axi_interconnect_0/M15_AXI] [get_bd_intf_pins axi_bram_input6/S_AXI]
connect_bd_intf_net [get_bd_intf_pins axi_bram_input7/S_AXI] [get_bd_intf_pins axi_interconnect_0/M16_AXI]
connect_bd_intf_net [get_bd_intf_pins axi_interconnect_0/M17_AXI] [get_bd_intf_pins axi_bram_input8/S_AXI]
connect_bd_intf_net [get_bd_intf_pins axi_bram_input9/S_AXI] [get_bd_intf_pins axi_interconnect_0/M18_AXI]
connect_bd_intf_net [get_bd_intf_pins axi_bram_input10/S_AXI] [get_bd_intf_pins axi_interconnect_0/M19_AXI]
connect_bd_intf_net [get_bd_intf_pins axi_interconnect_0/M20_AXI] [get_bd_intf_pins axi_bram_input11/S_AXI]
connect_bd_intf_net [get_bd_intf_pins axi_bram_input12/S_AXI] [get_bd_intf_pins axi_interconnect_0/M21_AXI]
connect_bd_intf_net [get_bd_intf_pins axi_bram_input13/S_AXI] [get_bd_intf_pins axi_interconnect_0/M22_AXI]
connect_bd_intf_net [get_bd_intf_pins axi_bram_input14/S_AXI] [get_bd_intf_pins axi_interconnect_0/M23_AXI]
connect_bd_intf_net [get_bd_intf_pins axi_interconnect_0/M24_AXI] [get_bd_intf_pins axi_bram_input15/S_AXI]
connect_bd_intf_net [get_bd_intf_pins axi_bram_input16/S_AXI] [get_bd_intf_pins axi_interconnect_0/M25_AXI]
connect_bd_intf_net [get_bd_intf_pins axi_interconnect_0/M26_AXI] [get_bd_intf_pins axi_bram_output4/S_AXI]
connect_bd_intf_net [get_bd_intf_pins axi_bram_output5/S_AXI] [get_bd_intf_pins axi_interconnect_0/M27_AXI]
connect_bd_intf_net [get_bd_intf_pins axi_interconnect_0/M28_AXI] [get_bd_intf_pins axi_bram_output6/S_AXI]
connect_bd_intf_net [get_bd_intf_pins axi_bram_output7/S_AXI] [get_bd_intf_pins axi_interconnect_0/M29_AXI]
connect_bd_intf_net [get_bd_intf_pins axi_interconnect_0/M30_AXI] [get_bd_intf_pins axi_bram_output8/S_AXI]
connect_bd_intf_net [get_bd_intf_pins axi_bram_output9/S_AXI] [get_bd_intf_pins axi_interconnect_0/M31_AXI]
connect_bd_intf_net [get_bd_intf_pins axi_bram_input17/S_AXI] [get_bd_intf_pins axi_interconnect_0/M32_AXI]
connect_bd_intf_net [get_bd_intf_pins axi_interconnect_0/M33_AXI] [get_bd_intf_pins axi_bram_input18/S_AXI]
connect_bd_intf_net [get_bd_intf_pins axi_interconnect_0/M34_AXI] [get_bd_intf_pins axi_bram_timer/S_AXI]
connect_bd_intf_net [get_bd_intf_pins axi_interconnect_0/M35_AXI] [get_bd_intf_pins axi_bram_output10/S_AXI]
connect_bd_intf_net [get_bd_intf_pins axi_interconnect_0/M36_AXI] [get_bd_intf_pins axi_bram_output11/S_AXI]
connect_bd_intf_net [get_bd_intf_pins axi_interconnect_0/M37_AXI] [get_bd_intf_pins axi_bram_output12/S_AXI]
connect_bd_intf_net [get_bd_intf_pins axi_interconnect_0/M38_AXI] [get_bd_intf_pins axi_bram_input19/S_AXI]
connect_bd_intf_net [get_bd_intf_pins axi_interconnect_0/M39_AXI] [get_bd_intf_pins axi_bram_input20/S_AXI]
connect_bd_intf_net [get_bd_intf_pins axi_bram_input21/S_AXI] [get_bd_intf_pins axi_interconnect_0/M40_AXI]
connect_bd_intf_net [get_bd_intf_pins axi_interconnect_0/M41_AXI] [get_bd_intf_pins axi_bram_input22/S_AXI]
connect_bd_intf_net [get_bd_intf_pins axi_bram_input23/S_AXI] [get_bd_intf_pins axi_interconnect_0/M42_AXI]
connect_bd_intf_net [get_bd_intf_pins axi_interconnect_0/M43_AXI] [get_bd_intf_pins axi_bram_input24/S_AXI]
connect_bd_intf_net [get_bd_intf_pins axi_bram_input25/S_AXI] [get_bd_intf_pins axi_interconnect_0/M44_AXI]
connect_bd_intf_net [get_bd_intf_pins axi_interconnect_0/M45_AXI] [get_bd_intf_pins axi_bram_input26/S_AXI]
connect_bd_intf_net [get_bd_intf_pins axi_bram_input27/S_AXI] [get_bd_intf_pins axi_interconnect_0/M46_AXI]
connect_bd_intf_net [get_bd_intf_pins axi_interconnect_0/M47_AXI] [get_bd_intf_pins axi_bram_input28/S_AXI]
connect_bd_intf_net [get_bd_intf_pins axi_bram_input29/S_AXI] [get_bd_intf_pins axi_interconnect_0/M48_AXI]
connect_bd_intf_net [get_bd_intf_pins axi_interconnect_0/M49_AXI] [get_bd_intf_pins axi_bram_input30/S_AXI]
connect_bd_intf_net [get_bd_intf_pins axi_bram_input31/S_AXI] [get_bd_intf_pins axi_interconnect_0/M50_AXI]
connect_bd_intf_net [get_bd_intf_pins axi_interconnect_0/M51_AXI] [get_bd_intf_pins axi_bram_input32/S_AXI]
connect_bd_intf_net [get_bd_intf_pins axi_bram_input33/S_AXI] [get_bd_intf_pins axi_interconnect_0/M52_AXI]
connect_bd_intf_net [get_bd_intf_pins axi_interconnect_0/M53_AXI] [get_bd_intf_pins axi_bram_input34/S_AXI]
connect_bd_intf_net [get_bd_intf_pins axi_bram_input35/S_AXI] [get_bd_intf_pins axi_interconnect_0/M54_AXI]
connect_bd_intf_net [get_bd_intf_pins axi_interconnect_0/M55_AXI] [get_bd_intf_pins axi_bram_input36/S_AXI]
connect_bd_intf_net [get_bd_intf_pins axi_bram_input37/S_AXI] [get_bd_intf_pins axi_interconnect_0/M56_AXI]
connect_bd_intf_net [get_bd_intf_pins axi_interconnect_0/M57_AXI] [get_bd_intf_pins axi_bram_input38/S_AXI]
connect_bd_intf_net [get_bd_intf_pins axi_bram_input39/S_AXI] [get_bd_intf_pins axi_interconnect_0/M58_AXI]
connect_bd_intf_net [get_bd_intf_pins axi_interconnect_0/M59_AXI] [get_bd_intf_pins axi_bram_input40/S_AXI]
connect_bd_intf_net [get_bd_intf_pins axi_bram_input41/S_AXI] [get_bd_intf_pins axi_interconnect_0/M60_AXI]
connect_bd_intf_net [get_bd_intf_pins axi_interconnect_0/M61_AXI] [get_bd_intf_pins axi_bram_input42/S_AXI]
connect_bd_intf_net -intf_net axi_bram_ctrl_1_BRAM_PORTA1 [get_bd_intf_ports BRAM_CTRL_CAP_RAM_0] [get_bd_intf_pins axi_bram_ctrl_cap_ram_0/BRAM_PORTA]
connect_bd_intf_net -intf_net axi_bram_ctrl_1_BRAM_PORTA2 [get_bd_intf_ports BRAM_CTRL_CAP_RAM_1] [get_bd_intf_pins axi_bram_ctrl_cap_ram_1/BRAM_PORTA]
connect_bd_intf_net -intf_net axi_bram_ctrl_1_BRAM_PORTA4 [get_bd_intf_ports BRAM_CTRL_DRP] [get_bd_intf_pins axi_bram_ctrl_drp/BRAM_PORTA]
connect_bd_intf_net -intf_net axi_bram_ctrl_1_BRAM_PORTA [get_bd_intf_ports BRAM_CTRL_REG_FILE] [get_bd_intf_pins axi_bram_ctrl_reg_file/BRAM_PORTA]
connect_bd_intf_net [get_bd_intf_ports clk_200_diff_in] [get_bd_intf_pins clk_wiz_0/CLK_IN1_D]
connect_bd_intf_net -intf_net axi_bram_ctrl_reg_file1_BRAM_PORTA [get_bd_intf_ports BRAM_CTRL_GTH_REG_FILE] [get_bd_intf_pins axi_bram_ctrl_gth_reg_file/BRAM_PORTA]
connect_bd_intf_net -intf_net axi_bram_ctrl_input1_BRAM_PORTA [get_bd_intf_ports BRAM_INPUT1] [get_bd_intf_pins axi_bram_input1/BRAM_PORTA]
connect_bd_intf_net -intf_net axi_bram_output_BRAM_PORTA [get_bd_intf_ports BRAM_OUTPUT1] [get_bd_intf_pins axi_bram_output1/BRAM_PORTA]
connect_bd_intf_net [get_bd_intf_ports BRAM_OUTPUT2] [get_bd_intf_pins axi_bram_output2/BRAM_PORTA]
connect_bd_intf_net [get_bd_intf_ports BRAM_OUTPUT3] [get_bd_intf_pins axi_bram_output3/BRAM_PORTA]
connect_bd_intf_net -intf_net axi_bram_input1_BRAM_PORTA [get_bd_intf_ports BRAM_INPUT2] [get_bd_intf_pins axi_bram_input2/BRAM_PORTA]
connect_bd_intf_net [get_bd_intf_ports BRAM_INPUT3] [get_bd_intf_pins axi_bram_input3/BRAM_PORTA]
connect_bd_intf_net [get_bd_intf_ports BRAM_INPUT4] [get_bd_intf_pins axi_bram_input4/BRAM_PORTA]
connect_bd_intf_net [get_bd_intf_ports BRAM_INPUT5] [get_bd_intf_pins axi_bram_input5/BRAM_PORTA]
connect_bd_intf_net [get_bd_intf_ports BRAM_INPUT6] [get_bd_intf_pins axi_bram_input6/BRAM_PORTA]
connect_bd_intf_net [get_bd_intf_ports BRAM_OUTPUT4] [get_bd_intf_pins axi_bram_output4/BRAM_PORTA]
connect_bd_intf_net [get_bd_intf_ports BRAM_OUTPUT5] [get_bd_intf_pins axi_bram_output5/BRAM_PORTA]
connect_bd_intf_net [get_bd_intf_ports BRAM_OUTPUT6] [get_bd_intf_pins axi_bram_output6/BRAM_PORTA]
connect_bd_intf_net [get_bd_intf_ports BRAM_OUTPUT7] [get_bd_intf_pins axi_bram_output7/BRAM_PORTA]
connect_bd_intf_net [get_bd_intf_ports BRAM_OUTPUT8] [get_bd_intf_pins axi_bram_output8/BRAM_PORTA]
connect_bd_intf_net [get_bd_intf_ports BRAM_OUTPUT9] [get_bd_intf_pins axi_bram_output9/BRAM_PORTA]
connect_bd_intf_net [get_bd_intf_ports BRAM_INPUT7] [get_bd_intf_pins axi_bram_input7/BRAM_PORTA]
connect_bd_intf_net [get_bd_intf_ports BRAM_INPUT8] [get_bd_intf_pins axi_bram_input8/BRAM_PORTA]
connect_bd_intf_net [get_bd_intf_ports BRAM_INPUT9] [get_bd_intf_pins axi_bram_input9/BRAM_PORTA]
connect_bd_intf_net [get_bd_intf_ports BRAM_INPUT10] [get_bd_intf_pins axi_bram_input10/BRAM_PORTA]
connect_bd_intf_net [get_bd_intf_ports BRAM_INPUT11] [get_bd_intf_pins axi_bram_input11/BRAM_PORTA]
connect_bd_intf_net [get_bd_intf_ports BRAM_INPUT12] [get_bd_intf_pins axi_bram_input12/BRAM_PORTA]
connect_bd_intf_net [get_bd_intf_ports BRAM_INPUT13] [get_bd_intf_pins axi_bram_input13/BRAM_PORTA]
connect_bd_intf_net [get_bd_intf_ports BRAM_INPUT14] [get_bd_intf_pins axi_bram_input14/BRAM_PORTA]
connect_bd_intf_net [get_bd_intf_ports BRAM_INPUT15] [get_bd_intf_pins axi_bram_input15/BRAM_PORTA]
connect_bd_intf_net [get_bd_intf_ports BRAM_INPUT16] [get_bd_intf_pins axi_bram_input16/BRAM_PORTA]
connect_bd_intf_net [get_bd_intf_ports BRAM_INPUT17] [get_bd_intf_pins axi_bram_input17/BRAM_PORTA]
connect_bd_intf_net [get_bd_intf_ports BRAM_INPUT18] [get_bd_intf_pins axi_bram_input18/BRAM_PORTA]
connect_bd_intf_net -intf_net axi_bram_output10_BRAM_PORTA [get_bd_intf_ports BRAM_TIMER] [get_bd_intf_pins axi_bram_timer/BRAM_PORTA]
connect_bd_intf_net [get_bd_intf_ports BRAM_OUTPUT10] [get_bd_intf_pins axi_bram_output10/BRAM_PORTA]
connect_bd_intf_net [get_bd_intf_ports BRAM_OUTPUT11] [get_bd_intf_pins axi_bram_output11/BRAM_PORTA]
connect_bd_intf_net [get_bd_intf_ports BRAM_OUTPUT12] [get_bd_intf_pins axi_bram_output12/BRAM_PORTA]
connect_bd_intf_net [get_bd_intf_ports BRAM_INPUT19] [get_bd_intf_pins axi_bram_input19/BRAM_PORTA]
connect_bd_intf_net [get_bd_intf_ports BRAM_INPUT20] [get_bd_intf_pins axi_bram_input20/BRAM_PORTA]
connect_bd_intf_net [get_bd_intf_ports BRAM_INPUT21] [get_bd_intf_pins axi_bram_input21/BRAM_PORTA]
connect_bd_intf_net [get_bd_intf_ports BRAM_INPUT22] [get_bd_intf_pins axi_bram_input22/BRAM_PORTA]
connect_bd_intf_net [get_bd_intf_ports BRAM_INPUT23] [get_bd_intf_pins axi_bram_input23/BRAM_PORTA]
connect_bd_intf_net [get_bd_intf_ports BRAM_INPUT24] [get_bd_intf_pins axi_bram_input24/BRAM_PORTA]
connect_bd_intf_net [get_bd_intf_ports BRAM_INPUT25] [get_bd_intf_pins axi_bram_input25/BRAM_PORTA]
connect_bd_intf_net [get_bd_intf_ports BRAM_INPUT26] [get_bd_intf_pins axi_bram_input26/BRAM_PORTA]
connect_bd_intf_net [get_bd_intf_ports BRAM_INPUT27] [get_bd_intf_pins axi_bram_input27/BRAM_PORTA]
connect_bd_intf_net [get_bd_intf_ports BRAM_INPUT28] [get_bd_intf_pins axi_bram_input28/BRAM_PORTA]
connect_bd_intf_net [get_bd_intf_ports BRAM_INPUT29] [get_bd_intf_pins axi_bram_input29/BRAM_PORTA]
connect_bd_intf_net [get_bd_intf_ports BRAM_INPUT30] [get_bd_intf_pins axi_bram_input30/BRAM_PORTA]
connect_bd_intf_net [get_bd_intf_ports BRAM_INPUT31] [get_bd_intf_pins axi_bram_input31/BRAM_PORTA]
connect_bd_intf_net [get_bd_intf_ports BRAM_INPUT32] [get_bd_intf_pins axi_bram_input32/BRAM_PORTA]
connect_bd_intf_net [get_bd_intf_ports BRAM_INPUT33] [get_bd_intf_pins axi_bram_input33/BRAM_PORTA]
connect_bd_intf_net [get_bd_intf_ports BRAM_INPUT34] [get_bd_intf_pins axi_bram_input34/BRAM_PORTA]
connect_bd_intf_net [get_bd_intf_ports BRAM_INPUT35] [get_bd_intf_pins axi_bram_input35/BRAM_PORTA]
connect_bd_intf_net [get_bd_intf_ports BRAM_INPUT36] [get_bd_intf_pins axi_bram_input36/BRAM_PORTA]
connect_bd_intf_net [get_bd_intf_ports BRAM_INPUT37] [get_bd_intf_pins axi_bram_input37/BRAM_PORTA]
connect_bd_intf_net [get_bd_intf_ports BRAM_INPUT38] [get_bd_intf_pins axi_bram_input38/BRAM_PORTA]
connect_bd_intf_net [get_bd_intf_ports BRAM_INPUT39] [get_bd_intf_pins axi_bram_input39/BRAM_PORTA]
connect_bd_intf_net [get_bd_intf_ports BRAM_INPUT40] [get_bd_intf_pins axi_bram_input40/BRAM_PORTA]
connect_bd_intf_net [get_bd_intf_ports BRAM_INPUT41] [get_bd_intf_pins axi_bram_input41/BRAM_PORTA]
connect_bd_intf_net [get_bd_intf_ports BRAM_INPUT42] [get_bd_intf_pins axi_bram_input42/BRAM_PORTA]
connect_bd_net -net ARESETN_1 [get_bd_pins proc_sys_reset_0/interconnect_aresetn] \
  [get_bd_pins axi_chip2chip_0/m_aresetn] [get_bd_pins axi_interconnect_0/ARESETN]
connect_bd_net [get_bd_ports axi_c2c_zynq_to_v7_clk] [get_bd_pins axi_chip2chip_0/axi_c2c_selio_rx_clk_in]
connect_bd_net [get_bd_ports axi_c2c_zynq_to_v7_data] [get_bd_pins axi_chip2chip_0/axi_c2c_selio_rx_data_in]
connect_bd_net [get_bd_pins axi_chip2chip_0/axi_c2c_link_status_out] [get_bd_ports axi_c2c_v7_to_zynq_link_status]
connect_bd_net [get_bd_pins axi_chip2chip_0/axi_c2c_selio_tx_clk_out] [get_bd_ports axi_c2c_v7_to_zynq_clk]
connect_bd_net [get_bd_pins axi_chip2chip_0/axi_c2c_selio_tx_data_out] [get_bd_ports axi_c2c_v7_to_zynq_data]
connect_bd_net [get_bd_pins clk_wiz_0/clk_out1] [get_bd_ports clk_out1_200mhz] [get_bd_pins axi_chip2chip_0/idelay_ref_clk]
connect_bd_net [get_bd_pins clk_wiz_0/clk_out2] [get_bd_ports clk_out2_100mhz]
connect_bd_net [get_bd_pins clk_wiz_0/clk_out3] \
  [get_bd_ports clk_out3_50mhz] [get_bd_pins axi_bram_ctrl_0/s_axi_aclk] [get_bd_pins axi_bram_ctrl_cap_ram_0/s_axi_aclk] \
  [get_bd_pins axi_bram_ctrl_cap_ram_1/s_axi_aclk] [get_bd_pins axi_bram_ctrl_drp/s_axi_aclk] \
  [get_bd_pins axi_bram_input1/s_axi_aclk] [get_bd_pins axi_bram_ctrl_reg_file/s_axi_aclk] \
  [get_bd_pins axi_bram_ctrl_gth_reg_file/s_axi_aclk] [get_bd_pins axi_bram_input3/s_axi_aclk] \
  [get_bd_pins axi_bram_input5/s_axi_aclk] [get_bd_pins axi_bram_input7/s_axi_aclk] [get_bd_pins axi_bram_input13/s_axi_aclk] \
  [get_bd_pins axi_bram_input4/s_axi_aclk] [get_bd_pins axi_bram_input6/s_axi_aclk] [get_bd_pins axi_bram_input8/s_axi_aclk] \
  [get_bd_pins axi_bram_input14/s_axi_aclk] [get_bd_pins axi_bram_input9/s_axi_aclk] \
  [get_bd_pins axi_bram_input15/s_axi_aclk] [get_bd_pins axi_bram_input10/s_axi_aclk] \
  [get_bd_pins axi_bram_input16/s_axi_aclk] [get_bd_pins axi_bram_input11/s_axi_aclk] \
  [get_bd_pins axi_bram_input17/s_axi_aclk] [get_bd_pins axi_bram_input12/s_axi_aclk] \
  [get_bd_pins axi_bram_input18/s_axi_aclk] [get_bd_pins axi_bram_output1/s_axi_aclk] \
  [get_bd_pins axi_bram_input2/s_axi_aclk] [get_bd_pins axi_bram_output3/s_axi_aclk] \
  [get_bd_pins axi_bram_output4/s_axi_aclk] [get_bd_pins axi_bram_output7/s_axi_aclk] \
  [get_bd_pins axi_bram_output5/s_axi_aclk] [get_bd_pins axi_bram_output8/s_axi_aclk] \
  [get_bd_pins axi_bram_output6/s_axi_aclk] [get_bd_pins axi_bram_output9/s_axi_aclk] \
  [get_bd_pins axi_bram_output2/s_axi_aclk] [get_bd_pins axi_chip2chip_0/m_aclk] \
  [get_bd_pins axi_chip2chip_0/m_axi_lite_aclk] [get_bd_pins proc_sys_reset_0/slowest_sync_clk] \
  [get_bd_pins xadc_wiz_0/s_axi_aclk] [get_bd_pins axi_bram_timer/s_axi_aclk] [get_bd_pins axi_bram_output10/s_axi_aclk] \
  [get_bd_pins axi_bram_output11/s_axi_aclk] [get_bd_pins axi_bram_output12/s_axi_aclk] \
  [get_bd_pins axi_bram_input19/s_axi_aclk] [get_bd_pins axi_bram_input20/s_axi_aclk] \
  [get_bd_pins axi_bram_input21/s_axi_aclk] [get_bd_pins axi_bram_input23/s_axi_aclk] \
  [get_bd_pins axi_bram_input24/s_axi_aclk] [get_bd_pins axi_bram_input25/s_axi_aclk] \
  [get_bd_pins axi_bram_input26/s_axi_aclk] [get_bd_pins axi_bram_input27/s_axi_aclk] \
  [get_bd_pins axi_bram_input28/s_axi_aclk] [get_bd_pins axi_bram_input29/s_axi_aclk] \
  [get_bd_pins axi_bram_input30/s_axi_aclk] [get_bd_pins axi_bram_input31/s_axi_aclk] \
  [get_bd_pins axi_bram_input32/s_axi_aclk] [get_bd_pins axi_bram_input33/s_axi_aclk] \
  [get_bd_pins axi_bram_input34/s_axi_aclk] [get_bd_pins axi_bram_input35/s_axi_aclk] \
  [get_bd_pins axi_bram_input36/s_axi_aclk] [get_bd_pins axi_bram_input37/s_axi_aclk] \
  [get_bd_pins axi_bram_input38/s_axi_aclk] [get_bd_pins axi_bram_input39/s_axi_aclk] \
  [get_bd_pins axi_bram_input40/s_axi_aclk] [get_bd_pins axi_bram_input41/s_axi_aclk] \
  [get_bd_pins axi_bram_input42/s_axi_aclk] [get_bd_pins axi_bram_input22/s_axi_aclk] [get_bd_pins axi_interconnect_0/ACLK] \
  [get_bd_pins axi_interconnect_0/S00_ACLK] [get_bd_pins axi_interconnect_0/M00_ACLK] \
  [get_bd_pins axi_interconnect_0/M01_ACLK] [get_bd_pins axi_interconnect_0/M02_ACLK] \
  [get_bd_pins axi_interconnect_0/M03_ACLK] [get_bd_pins axi_interconnect_0/M04_ACLK] \
  [get_bd_pins axi_interconnect_0/M05_ACLK] [get_bd_pins axi_interconnect_0/M06_ACLK] \
  [get_bd_pins axi_interconnect_0/M07_ACLK] [get_bd_pins axi_interconnect_0/M08_ACLK] \
  [get_bd_pins axi_interconnect_0/M09_ACLK] [get_bd_pins axi_interconnect_0/M10_ACLK] \
  [get_bd_pins axi_interconnect_0/M11_ACLK] [get_bd_pins axi_interconnect_0/M12_ACLK] \
  [get_bd_pins axi_interconnect_0/M13_ACLK] [get_bd_pins axi_interconnect_0/M14_ACLK] \
  [get_bd_pins axi_interconnect_0/M15_ACLK] [get_bd_pins axi_interconnect_0/M16_ACLK] \
  [get_bd_pins axi_interconnect_0/M17_ACLK] [get_bd_pins axi_interconnect_0/M18_ACLK] \
  [get_bd_pins axi_interconnect_0/M19_ACLK] [get_bd_pins axi_interconnect_0/M20_ACLK] \
  [get_bd_pins axi_interconnect_0/M21_ACLK] [get_bd_pins axi_interconnect_0/M22_ACLK] \
  [get_bd_pins axi_interconnect_0/M23_ACLK] [get_bd_pins axi_interconnect_0/M24_ACLK] \
  [get_bd_pins axi_interconnect_0/M25_ACLK] [get_bd_pins axi_interconnect_0/M26_ACLK] \
  [get_bd_pins axi_interconnect_0/M27_ACLK] [get_bd_pins axi_interconnect_0/M28_ACLK] \
  [get_bd_pins axi_interconnect_0/M29_ACLK] [get_bd_pins axi_interconnect_0/M30_ACLK] \
  [get_bd_pins axi_interconnect_0/M31_ACLK] [get_bd_pins axi_interconnect_0/M32_ACLK] \
  [get_bd_pins axi_interconnect_0/M33_ACLK] [get_bd_pins axi_interconnect_0/M34_ACLK] \
  [get_bd_pins axi_interconnect_0/M35_ACLK] [get_bd_pins axi_interconnect_0/M36_ACLK] \
  [get_bd_pins axi_interconnect_0/M37_ACLK] [get_bd_pins axi_interconnect_0/M38_ACLK] \
  [get_bd_pins axi_interconnect_0/M39_ACLK] [get_bd_pins axi_interconnect_0/M40_ACLK] \
  [get_bd_pins axi_interconnect_0/M41_ACLK] [get_bd_pins axi_interconnect_0/M42_ACLK] \
  [get_bd_pins axi_interconnect_0/M43_ACLK] [get_bd_pins axi_interconnect_0/M44_ACLK] \
  [get_bd_pins axi_interconnect_0/M45_ACLK] [get_bd_pins axi_interconnect_0/M46_ACLK] \
  [get_bd_pins axi_interconnect_0/M47_ACLK] [get_bd_pins axi_interconnect_0/M48_ACLK] \
  [get_bd_pins axi_interconnect_0/M49_ACLK] [get_bd_pins axi_interconnect_0/M50_ACLK] \
  [get_bd_pins axi_interconnect_0/M51_ACLK] [get_bd_pins axi_interconnect_0/M52_ACLK] \
  [get_bd_pins axi_interconnect_0/M53_ACLK] [get_bd_pins axi_interconnect_0/M54_ACLK] \
  [get_bd_pins axi_interconnect_0/M55_ACLK] [get_bd_pins axi_interconnect_0/M56_ACLK] \
  [get_bd_pins axi_interconnect_0/M57_ACLK] [get_bd_pins axi_interconnect_0/M58_ACLK] \
  [get_bd_pins axi_interconnect_0/M59_ACLK] [get_bd_pins axi_interconnect_0/M60_ACLK] \
  [get_bd_pins axi_interconnect_0/M61_ACLK]
connect_bd_net [get_bd_pins clk_wiz_0/locked] [get_bd_pins proc_sys_reset_0/dcm_locked]
connect_bd_net -net m_aresetn_1 [get_bd_ports axi_c2c_zynq_to_v7_reset] [get_bd_pins proc_sys_reset_0/ext_reset_in]
